# Altium schematic sheet MAZ000177 - Diagrama eléctrico.SchDoc: MAZ000177 - Diagrama eléctrico
size A; ApprovedBy: Christian Ledwidth; CheckedBy: Nahuel Martinez; Author: Santiago Marti; CompanyName: Body Health; DrawnBy: Santiago Marti; Revision: A; SheetNumber: 2; SheetTotal: 2
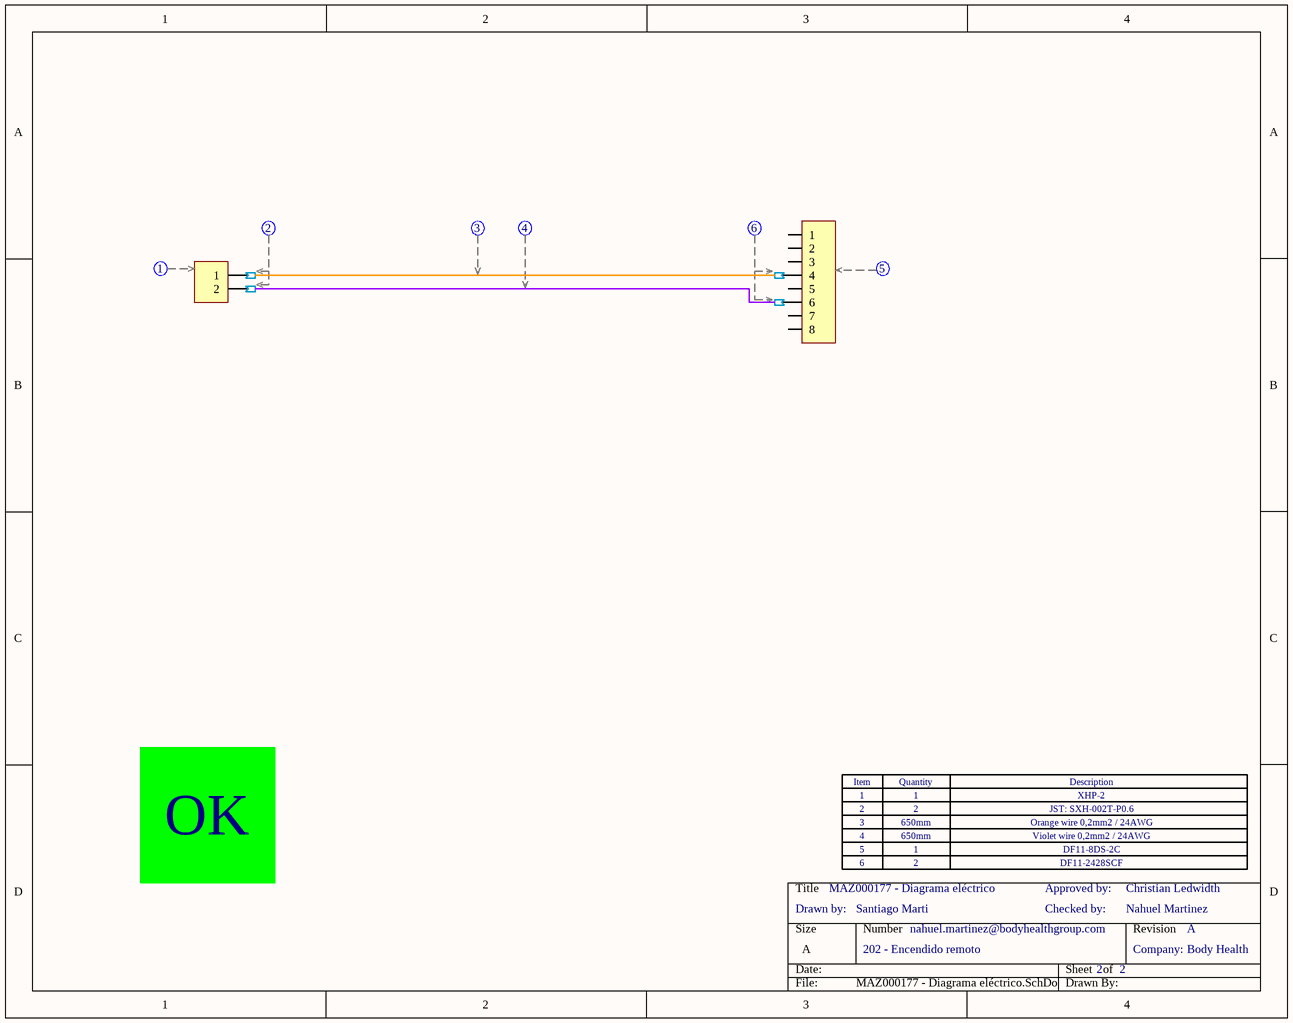
[diagram p0: MAZ000177 - Diagrama eléctrico.SchDoc]

## Parts
Con1  DF11-8DS-2C  (value not drawn)  (parts C,D of 4)
Con2  XHP-2  (value not drawn)  (parts C,D of 4)
Soc1  sock_XHP_SXH-002T-P0.6  (value not drawn)  (parts A,B of 2)
Soc2  sock_XHP_SXH-002T-P0.6  (value not drawn)  (parts A,B of 2)
Soc3  sock_XHP_SXH-002T-P0.6  (value not drawn)  (part A of 2)
Soc4  sock_DF11-2428SCF  (value not drawn)  (parts A,B of 2)
Soc5  sock_DF11-2428SCF  (value not drawn)  (part B of 2)
Zoc1  Zócalo_Header  (value not drawn)
Zoc2  Zócalo_Item  (value not drawn)
Zoc3  Zócalo_Item  (value not drawn)
Zoc4  Zócalo_Item  (value not drawn)
Zoc5  Zócalo_Item  (value not drawn)
Zoc6  Zócalo_Item  (value not drawn)
Zoc7  Zócalo_Item  (value not drawn)

## Nets
NetCon1_4: Con1.4 Soc4.0
NetCon1_6: Con1.6 Soc5.0
NetCon2_1: Con2.1 Soc1.0
NetCon2_2: Con2.2 Soc2.0
NetSoc1_1: Soc1.1 Soc4.1
NetSoc2_1: Soc2.1 Soc5.1

Not connected (* = marked no-connect by the designer): Con1 1 2 3 5 7 8

## Notes on the sheet
- OK
- 1
- 2
- 3
- 4
- 650mm
- XHP-2
- JST: SXH-002T-P0.6
- Orange wire 0,2mm2 / 24AWG
- Violet wire 0,2mm2 / 24AWG
- Drawn by:
- 5
- 6
- Checked by:
- Approved by:
- DF11-8DS-2C
- DF11-2428SCF
- 202 - Encendido remoto
- nahuel.martinez@bodyhealthgroup.com
- Company:
- (in symbol Zócalo_Header) Item; Quantity; Description

## Library data of the parts
Con1 = DF11-8DS-2C: CONN SOCKET 8POS 2MM DUAL CRIMP; Fabricante: Hirose Electric Co Ltd; CallOut: 6; Cod.DigiKey: H2022-ND; Cod.Fabricante: DF11-8DS-2C; ComponentLink1Description: Manufacturer Link; ComponentLink1URL: https://www.hirose.com/product/document?clcode=CL0543-0544-8-52&productname=DF11-26DP-2DS(52)&series=DF11&documenttype=Catalog&lang=en&documentid=D31688_en; DIGIKEYx50: 0.16800; DIGIKEYx100: 0.15600
Con2 = XHP-2: CONN HOUSING 2.5MM 2POS; Fabricante: JST Sales America Inc.; CallOut: 1; Cod.DigiKey: 455-2266-ND; Cod.Fabricante: XHP-2; ComponentLink1Description: Manufacturer Link; ComponentLink1URL: http://www.jst-mfg.com/product/pdf/eng/eXH.pdf; DIGIKEYx50: 0.05620; DIGIKEYx100: NO
Soc1 = sock_XHP_SXH-002T-P0.6: CONN SOCKET 26-30AWG CRIMP TIN; Fabricante: JST Sales America Inc.; CallOut: 2; Cod.DigiKey: 455-2261-1-ND; Cod.Fabricante: SXH-002T-P0.6; ComponentLink1Description: Manufacturer Link; ComponentLink1URL: http://www.jst-mfg.com/product/pdf/eng/eXH.pdf; DIGIKEYx100: 0.03300; DIGIKEYx50: 0.03420
Soc2 = sock_XHP_SXH-002T-P0.6: CONN SOCKET 26-30AWG CRIMP TIN; Fabricante: JST Sales America Inc.; CallOut: 3; Cod.DigiKey: 455-2261-1-ND; Cod.Fabricante: SXH-002T-P0.6; ComponentLink1Description: Manufacturer Link; ComponentLink1URL: http://www.jst-mfg.com/product/pdf/eng/eXH.pdf; DIGIKEYx100: 0.03300; DIGIKEYx50: 0.03420
Soc3 = sock_XHP_SXH-002T-P0.6: CONN SOCKET 26-30AWG CRIMP TIN; Fabricante: JST Sales America Inc.; CallOut: 4; Cod.DigiKey: 455-2261-1-ND; Cod.Fabricante: SXH-002T-P0.6; ComponentLink1Description: Manufacturer Link; ComponentLink1URL: http://www.jst-mfg.com/product/pdf/eng/eXH.pdf; DIGIKEYx100: 0.03300; DIGIKEYx50: 0.03420
Soc4 = sock_DF11-2428SCF: CONN SOCKET 18-24AWG CRIMP TIN; Fabricante: Hirose Electric Co Ltd; CallOut: 5; Cod.DigiKey: H1504CT-ND; Cod.Fabricante: DF11-2428SCF; ComponentLink1Description: Manufacturer Link; ComponentLink1URL: https://www.hirose.com/product/document?clcode=CL0543-0544-8-52&productname=DF11-26DP-2DS(52)&series=DF11&documenttype=Catalog&lang=en&documentid=D31688_en; DIGIKEYx100: 0.02900; DIGIKEYx50: 0.03000
Soc5 = sock_DF11-2428SCF: CONN SOCKET 18-24AWG CRIMP TIN; Fabricante: Hirose Electric Co Ltd; Cod.DigiKey: H1504CT-ND; Cod.Fabricante: DF11-2428SCF; ComponentLink1Description: Manufacturer Link; ComponentLink1URL: https://www.hirose.com/product/document?clcode=CL0543-0544-8-52&productname=DF11-26DP-2DS(52)&series=DF11&documenttype=Catalog&lang=en&documentid=D31688_en; DIGIKEYx100: 0.02900; CallOut: *; DIGIKEYx50: 0.03000
Zoc1 = Zócalo_Header: Header para el zócalo de referencias
Zoc2-Zoc7 = Zócalo_Item: Ítem para el zócalo de referencias; Desginator: *; Quantity: *; ItemDescription: *